# EAGLE design ADDINBRD_V1 (EAGLE 7.7.0)

## Sheet 1 of 2
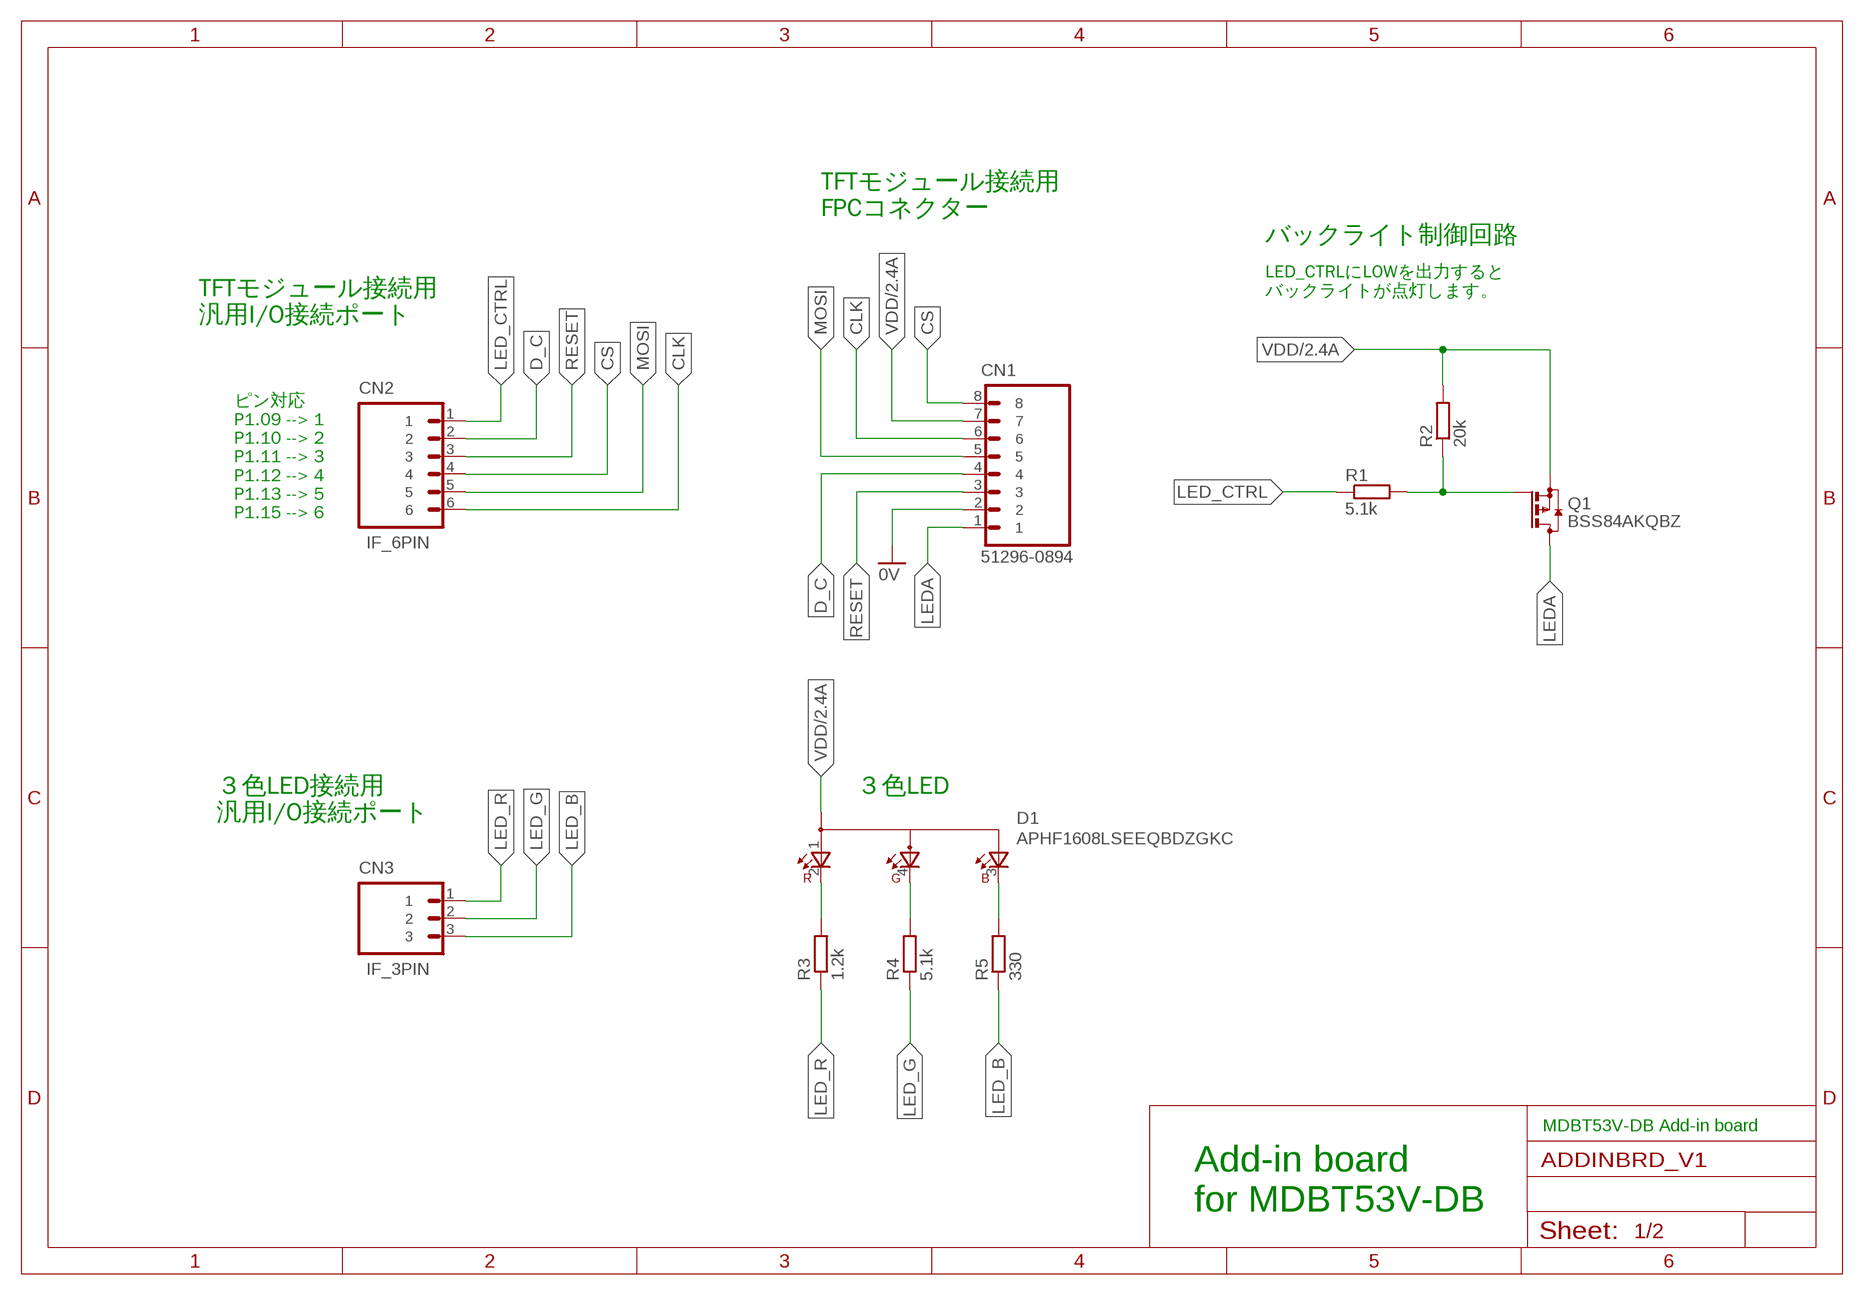
[diagram p0: schematic, sheet 1]

### Parts
CN1  51296-0894  [51296-0894]
CN2  IF_6PIN  [HEADER_6PIN]
CN3  IF_3PIN  [HEADER_3PIN]
D1  APHF1608LSEEQBDZGKC  [APHF1608LSEEQBDZGKC]
Q1  BSS84AKQBZ  [BSS84AKQB]
R1  5.1k  RESISTOR_0402N  [R0402N]
R2  20k  RESISTOR_0402N  [R0402N]
R3  1.2k  RESISTOR_0402N  [R0402N]
R4  5.1k  RESISTOR_0402N  [R0402N]
R5  330  RESISTOR_0402N  [R0402N]

### Nets
0V: CN1.2 ; also sheet 2
CLK: CN1.6 CN2.6
CS: CN1.8 CN2.4
D_C: CN1.4 CN2.2
LED_B: CN3.3 R5.1
LED_CTRL: CN2.1 R1.1
LED_G: CN3.2 R4.1
LED_R: CN3.1 R3.1
LEDA: CN1.1 Q1.3(D)
MOSI: CN1.5 CN2.5
N$1: Q1.1(G) R1.2 R2.1
N$5: D1.4(CGREEN) R4.2
N$6: D1.2(CRED) R3.2
N$10: D1.3(CBLUE) R5.2
RESET: CN1.3 CN2.3
VDD: CN1.7 D1.1(A) Q1.2(S) R2.2 ; also sheet 2

### Notes on the sheet
- TFTモジュール接続用
  FPCコネクター
- バックライト制御回路
- TFTモジュール接続用
  汎用I/O接続ポート
- LED_CTRLにLOWを出力すると
  バックライトが点灯します。
- ピン対応
  P1.09 --> 1
  P1.10 --> 2
  P1.11 --> 3
  P1.12 --> 4
  P1.13 --> 5
  P1.15 --> 6
- ３色LED接続用
  汎用I/O接続ポート
- ３色LED
- MDBT53V-DB Add-in board
- Add-in board
  for MDBT53V-DB

## Sheet 2 of 2
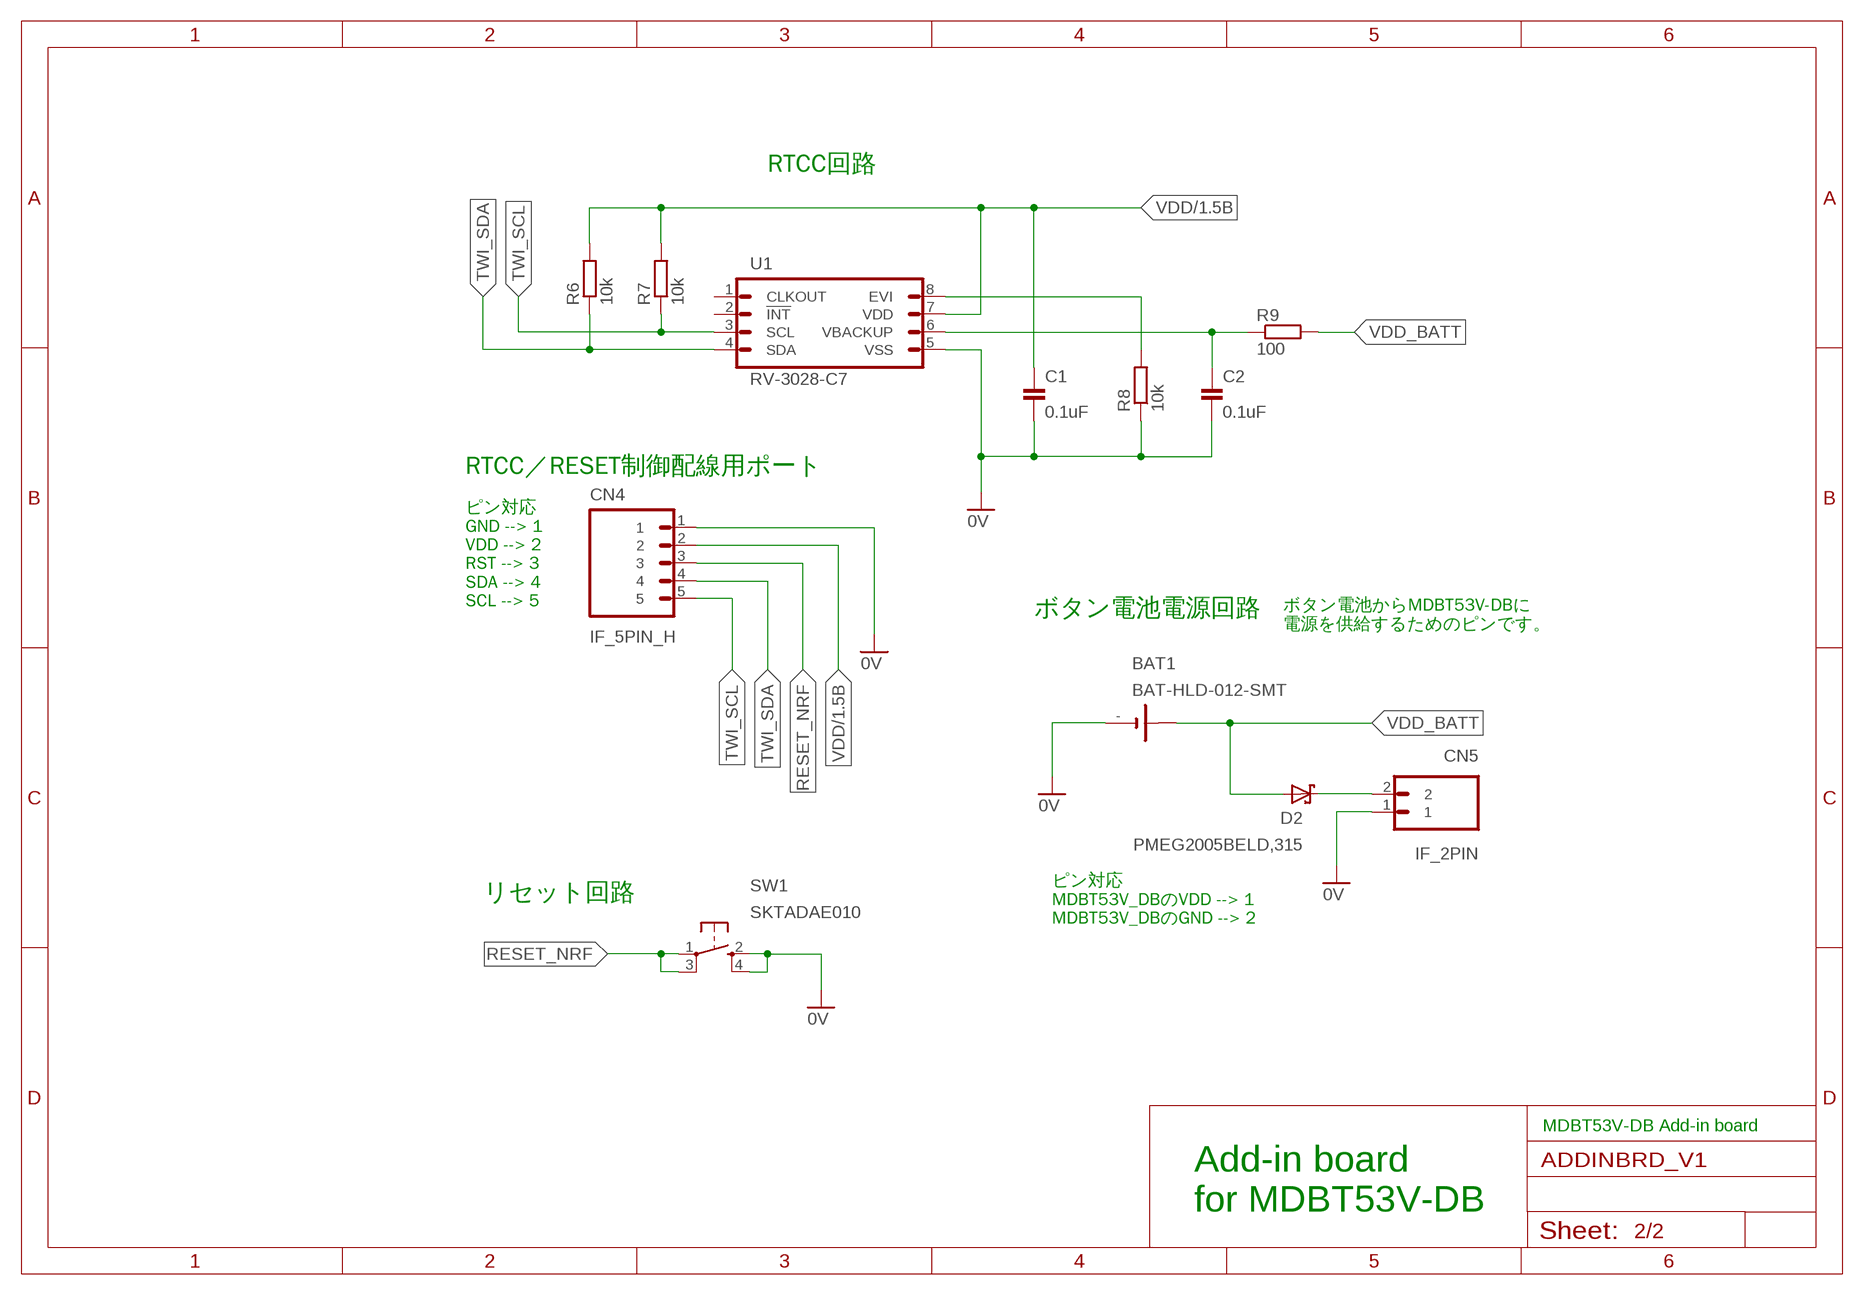
[diagram p1: schematic, sheet 2]

### Parts
BAT1  BAT-HLD-012-SMT  [BAT-HLD-012-SMT]
C1  0.1uF  CAP_0402N  [C0402N]
C2  0.1uF  CAP_0402N  [C0402N]
CN4  IF_5PIN_H  [HEADER_5PIN]
CN5  IF_2PIN  [HEADER_2PIN]
D2  PMEG2005BELD,315  [DFN1006D-2]
R6  10k  RESISTOR_0402N  [R0402N]
R7  10k  RESISTOR_0402N  [R0402N]
R8  10k  RESISTOR_0402N  [R0402N]
R9  100  RESISTOR_0402N  [R0402N]
SW1  SKTADAE010  [SKTADAE010]
U1  RV-3028-C7  [SON-8]

### Nets
0V: BAT1.- C1.2 C2.2 CN4.1 CN5.1 R8.1 SW1.2(S) SW1.4(S1) U1.5(VSS) ; also sheet 1
N$2: CN5.2 D2.1(C)
N$3: C2.1 R9.1 U1.6(VBACKUP)
N$4: R8.2 U1.8(EVI)
RESET_NRF: CN4.3 SW1.1(P) SW1.3(P1)
TWI_SCL: CN4.5 R7.1 U1.3(SCL)
TWI_SDA: CN4.4 R6.1 U1.4(SDA)
VDD: C1.1 CN4.2 R6.2 R7.2 U1.7(VDD) ; also sheet 1
VDD_BATT: BAT1.+@2(+) D2.2(A) R9.2
Unconnected: U1.1(CLKOUT) U1.2(!INT!)

### Notes on the sheet
- RTCC回路
- RTCC／RESET制御配線用ポート
- ピン対応
  GND --> 1
  VDD --> 2
  RST --> 3
  SDA --> 4
  SCL --> 5
- ボタン電池電源回路
- ボタン電池からMDBT53V-DBに
  電源を供給するためのピンです。
- ピン対応
  MDBT53V_DBのVDD --> 1
  MDBT53V_DBのGND --> 2
- リセット回路
- MDBT53V-DB Add-in board
- Add-in board
  for MDBT53V-DB

## Library data of the parts
BAT1 = Connectors:BAT-HLD-012-SMT: ボタン電池ホルダー(CR1216/1225)
C1 C2 = Parts:CAP: コンデンサー
CN1 = Connectors:51296-0894: 0.5mm-8pins FFC & FPC Connector Right Angle, Bottom Contact
CN2 = Connectors:IF_6PIN: 6-pin インターフェース
CN3 = Connectors:IF_3PIN: 3-pin インターフェース
CN4 = Connectors:IF_5PIN: 5-pin インターフェース
CN5 = Connectors:IF_2PIN: 2-pin インターフェース
D1 = Parts:APHF1608: 1.6 x 0.8 mm Full-Color Surface Mount LED
D2 = Parts:PMEG2005: ショットキーダイオード If - 順電流: 500 mA Vrrm - 繰返し逆電圧: 20 V Vf - 順電圧: 0.39 V Ifsm - 順方向サージ電流: 10 A 最低動作温度: - 65 C 最高動作温度: + 150 C
Q1 = Parts:BSS84AKQB: P-Channel MOSFET DFN-1110D-3
R1-R9 = Parts:RESISTOR: 抵抗器
SW1 = Parts:SKTADAE010: 表面実装用タクトスイッチ 2.6×1.6ｍｍ小型重作動力タイプ ・作動力：2.4 N ・操作方向：垂直 ・移動量：0.11 mm ・定格：50 mA 12 VDC
U1 = ICs:RV-3028-C7: Extreme Low Power RTC Module Supply Voltage: 1.2 V 〜 5.5 V Operating Temperature: - 40 C 〜 + 85 C 3.2 mm x 1.5 mm

## Board
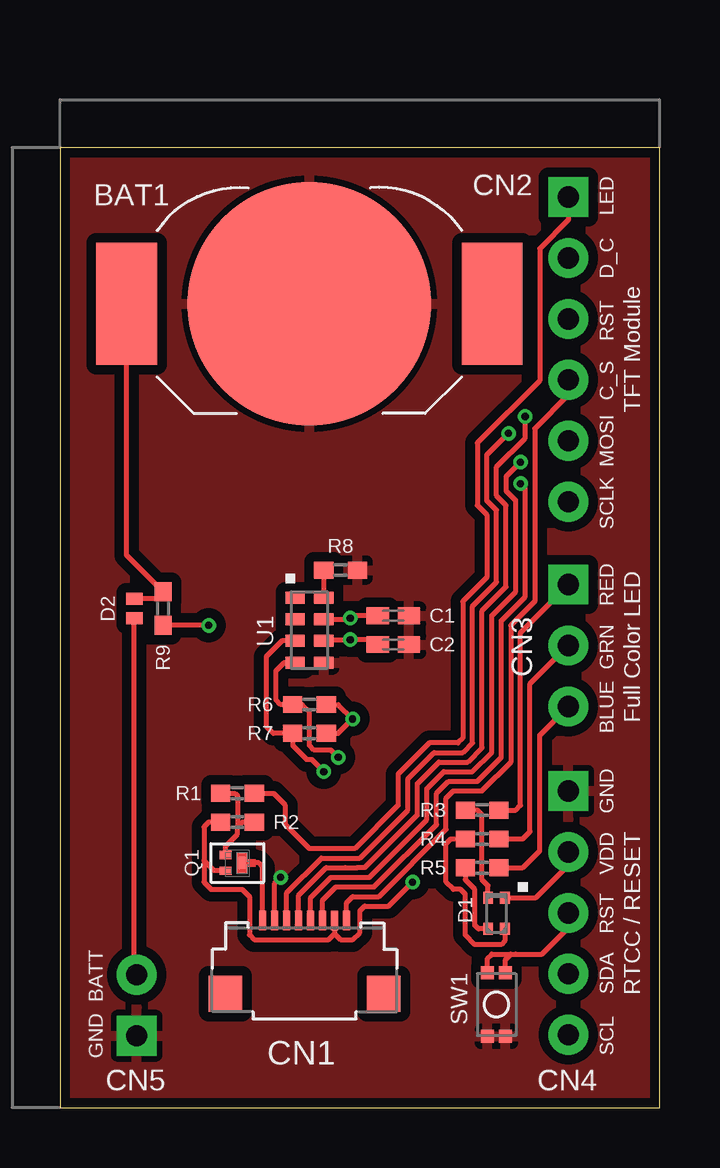
[diagram p2: board, top side]
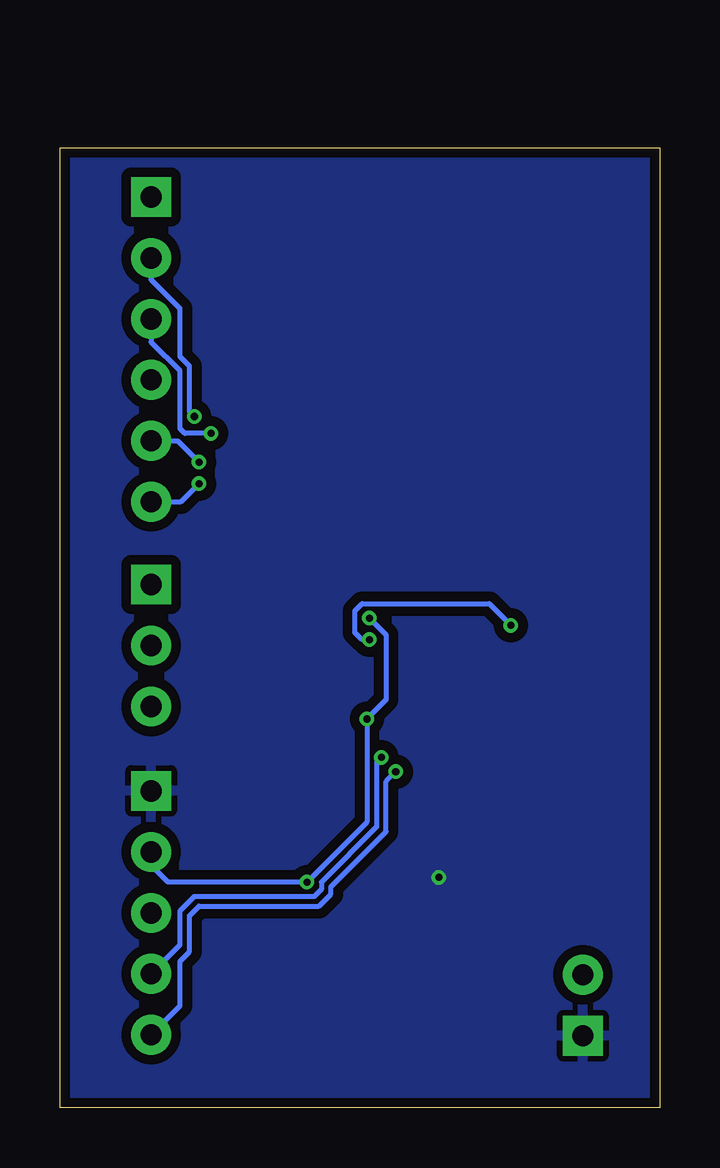
[diagram p3: board, bottom side, seen from below]

Size 25 x 40 mm. Coordinates in mm from the lower left corner, seen from the top.
Outline: 0,0 25,0 25,40 0,40 0,0
Copper layers (1*16): Top 0.035mm / dielectric 1.5mm / Bottom 0.035mm
Design rules "SeeedStudio_2layer_DRU_no_angle_20140221 *": minimum track width 6mil, minimum drill 0.3mm, track to track 6mil, track to pad 6mil, pad to pad 6mil, via to via 6mil, smd to smd 0mil, copper to edge 10mil, drill to drill 10mil, minimum pad ring 10mil, minimum via ring 6mil, stop-mask expansion 2mil, vias tented up to drill 100mil, thermal gap 10mil

### Footprints (pad centres in the part's own frame; a part is rotated, then mirrored left to right if it is on the bottom)
BAT-HLD-012-SMT = smd 2.54 x 5.08: +@1 -7.62,0; +@2 7.62,0 | smd 10.16 x 10.16: - 0,0
C0402N = smd 0.925 x 0.7: 1 -0.65,0; 2 0.65,0
51296-0894 = smd 0.28 x 0.8: 1 -1.75,3.8; 2 -1.25,3.8; 3 -0.75,3.8; 4 -0.25,3.8; 5 0.25,3.8; 6 0.75,3.8; 7 1.25,3.8; 8 1.75,3.8 | smd 1.4 x 1.5: FG1 -3.3,0.75; FG2 3.3,0.75
HEADER_6PIN = drill 0.889 pad 1.651 square: 1 -6.35,0 | drill 0.889 pad 1.651: 2 -3.81,0; 3 -1.27,0; 4 1.27,0; 5 3.81,0; 6 6.35,0
HEADER_3PIN = drill 0.889 pad 1.651 square: 1 0,0 | drill 0.889 pad 1.651: 2 2.54,0; 3 5.08,0
HEADER_5PIN = drill 0.889 pad 1.651 square: 1 0,0 | drill 0.889 pad 1.651: 2 2.54,0; 3 5.08,0; 4 7.62,0; 5 10.16,0
HEADER_2PIN = drill 0.889 pad 1.651 square: 1 0,0 | drill 0.889 pad 1.651: 2 2.54,0
APHF1608LSEEQBDZGKC = smd 0.5 x 0.4: 1 -0.65,0.35; 2 -0.65,-0.35; 3 0.65,-0.35; 4 0.65,0.35
DFN1006D-2 = smd 0.5 x 0.7: 1 -0.4,0; 2 0.4,0
BSS84AKQB = smd 0.35 x 0.5: 1 0.325,0.5; 2 -0.325,0.5 | smd 0.5 x 0.3: 3 0,-0.19
R0402N = smd 0.8 x 0.7: 1 -0.7,0; 2 0.7,0
SKTADAE010 = smd 0.55 x 0.55: 1 -1.325,0.375; 2 1.325,0.375; 3 -1.325,-0.375; 4 1.325,-0.375
SON-8 = smd 0.5 x 0.8: 1 0.25,0.4; 2 1.15,0.4; 3 2.05,0.4; 4 2.95,0.4; 5 2.95,1.6; 6 2.05,1.6; 7 1.15,1.6; 8 0.25,1.6

### Placement (x,y rotation side)
BAT1  10.4,33.5 180 top
C1  13.9,20.5 0 top
C2  13.9,19.3 0 top
CN1  10.2,4 0 top
CN2  21.2,31.6 270 top
CN3  21.2,21.8 270 top
CN4  21.2,13.2 270 top
CN5  3.2,3 90 top
D1  18.2,8.1 270 top
D2  3.1,20.8 90 top
Q1  7.4,10.2 90 top
R1  7.4,13.1 180 top
R2  7.4,11.9 180 top
R3  17.6,12.4 180 top
R4  17.6,11.2 180 top
R5  17.6,10 180 top
R6  10.4,16.8 0 top
R7  10.4,15.6 0 top
R8  11.7,22.4 180 top
R9  4.3,20.8 90 top
SW1  18.2,4.3 270 top
U1  9.4,21.5 270 top

### Tracks (layer width: path | path; a pad name or v marks a point on that pad's centre or on a via)
0V  (via drill 0.3)
  Top 0.203: CN1.2 8.95,9.35 v9.2,9.6
  pour Top (isolate 0.406, rank 3): -1,-1 26,-1 26,41 -1,41
  pour Bottom (isolate 0.406, rank 3): -2,-2 27,-2 27,42 -2,42
CLK  (via drill 0.3)
  Top 0.203: CN1.6 10.95,8.65 11.5,9.2 13.1,9.2 15.7,11.8 15.7,13.1 16.2,13.6 17.4,13.6 18.4,14.6 18.4,20.3 19.4,21.3 19.4,25.8 v19.2,26
  Bottom 0.203: CN2.6 19.95,25.25 v19.2,26
CS
  Top 0.203: CN1.8 11.95,8.55 12.2,8.8 13.3,8.8 16.1,11.6 16.1,12.9 16.4,13.2 17.6,13.2 18.8,14.4 18.8,20.1 19.8,21.1 19.8,28.3 21.2,29.7 CN2.4
D_C  (via drill 0.3)
  Top 0.203: CN1.4 9.95,8.85 11.1,10 11.9,10 12.4,10 12.7,10 14.9,12.2 14.9,13.5 15.8,14.4 17,14.4 17.6,15 17.6,20.7 18.6,21.7 18.6,25.1 18.2,25.5 18.2,26.7 19.4,27.9 v19.4,28.8
  Bottom 0.203: v19.4,28.8 19.6,29 19.6,30.9 20,31.3 20,33.3 21.2,34.5 CN2.2
LED_B
  Top 0.203: R5.1 19.3,10 20,10.7 20,15.52 CN3.3
LED_CTRL
  Top 0.203: CN2.1 21.2,37 20,35.8 20,30.3 17.4,27.7 17.4,25.1 17.8,24.7 17.8,22.1 16.8,21.1 16.8,15.4 16.6,15.2 15.4,15.2 14.1,13.9 14.1,12.6 12.3,10.8 10.4,10.8 9.4,11.8 9.4,12.6 8.9,13.1 R1.1
LED_G
  Top 0.203: R4.1 19.3,11.2 19.6,11.5 19.6,17.66 CN3.2
LED_R
  Top 0.203: R3.1 19,12.4 19.2,12.6 19.2,19.8 CN3.1
LEDA
  Top 0.203: CN1.1 8.45,10.05 8.3,10.2 Q1.3
MOSI  (via drill 0.3)
  Top 0.203: v19.2,26.9 18.6,26.3 18.6,25.7 19,25.3 19,21.5 18,20.5 18,14.8 17.2,14 16,14 15.3,13.3 15.3,12 12.9,9.6 11.3,9.6 10.45,8.75 CN1.5
  Bottom 0.203: CN2.5 20.09,27.79 v19.2,26.9
N$1
  Top 0.203: R1.2 7.3,13.1 7.4,13 7.4,11.7 | R2.1 7.6,11.9 7.4,11.7 | Q1.1 6.9,10.9 7.4,11.4 7.4,11.5 7.4,11.7
N$2
  Top 0.203: CN5.2 3.1,5.64 D2.1
N$3  (via drill 0.3)
  Top 0.203: v6.2,20.1 R9.1 | U1.6 11.05,19.5 v12.1,19.5 13.05,19.5 C2.1
  Bottom 0.203: v12.1,19.5 12.4,19.5 12.7,19.8 12.7,20.7 12.4,21 7.1,21 v6.2,20.1
N$4
  Top 0.203: U1.8 R8.2
N$5
  Top 0.203: D1.4 18.55,6.95 18.4,6.8 17.3,6.8 16.9,7.2 16.9,8.9 16.7,9.1 16.4,9.1 16.1,9.4 16.1,11 16.3,11.2 R4.2
N$6
  Top 0.203: D1.2 17.85,9.25 17.6,9.5 17.6,12.2 17.4,12.4 R3.2
N$10
  Top 0.203: D1.3 17.45,7.45 17.3,7.6 17.3,9.1 16.9,9.5 R5.2
RESET  (via drill 0.3)
  Top 0.203: CN1.3 9.45,8.95 10.9,10.4 12.5,10.4 14.5,12.4 14.5,13.7 15.6,14.8 16.8,14.8 17.2,15.2 17.2,20.9 18.2,21.9 18.2,24.9 17.8,25.3 17.8,27.2 v18.7,28.1
  Bottom 0.203: CN2.3 21.2,31.9 20,30.7 20,28.3 19.8,28.1 v18.7,28.1
RESET_NRF
  Top 0.203: SW1.1 18.57,6.17 18.8,6.4 | 18.8,6.4 19,6.4 20.1,6.4 21.2,7.5 CN4.3 | SW1.3 17.82,6.22 18,6.4 18.8,6.4
TWI_SCL  (via drill 0.3)
  Top 0.203: v11,14 10.5,14.5 10.3,14.5 9.7,15.1 R7.1 8.9,15.6 8.6,15.9 8.6,18.8 9.25,19.45 U1.3
  Bottom 0.203: CN4.5 20,4.24 20,6.1 19.6,6.5 19.6,8 19.2,8.4 14.2,8.4 13.7,8.9 13.7,9.2 11.4,11.5 11.4,13.6 v11,14
TWI_SDA  (via drill 0.3)
  Top 0.203: U1.4 9.35,18.55 9,18.2 9,17 9.2,16.8 R6.1 10.1,16.8 10.4,16.5 10.4,15.1 10.6,14.9 11.3,14.9 v11.6,14.6
  Bottom 0.203: v11.6,14.6 11.8,14.4 11.8,11.7 14.1,9.4 14.1,9.1 14.4,8.8 19.4,8.8 20,8.2 20,6.78 CN4.4
VDD  (via drill 0.3)
  Top 0.203: D1.1 19.85,8.75 21.2,10.1 CN4.2 | R2.2 6.2,11.9 6,11.7 6,10.3 | 6,10.3 6,9.4 6.3,9.1 7.6,9.1 7.9,8.8 7.9,7.2 8.1,7 11.2,7 11.45,7.25 | Q1.2 6.42,9.88 6,10.3 | CN1.7 11.45,7.25 | 11.45,7.25 11.7,7 12.2,7 12.5,7.3 12.5,8.2 12.7,8.4 13.7,8.4 v14.7,9.4 | R6.2 11.6,16.8 v12.2,16.2 11.6,15.6 R7.2 | U1.7 12.05,20.35 v12.1,20.4 12.2,20.5 C1.1
  Bottom 0.203: CN4.2 21.2,10.1 20.5,9.4 v14.7,9.4 12.2,11.9 v12.2,16.2 | 11.8,16.6 v12.2,16.2 | v12.1,20.4 11.4,19.7 11.4,17 v12.2,16.2
VDD_BATT
  Top 0.203: D2.2 4,21.2 R9.2 2.78,23.02 BAT1.+@2

### Text on the board
tPlace: LED | D_C | RST | TFT Module | C_S | MOSI | SCLK | RED | GRN | Full Color LED | BLUE | GND | VDD | RST | RTCC / RESET | BATT | SDA | GND | SCL